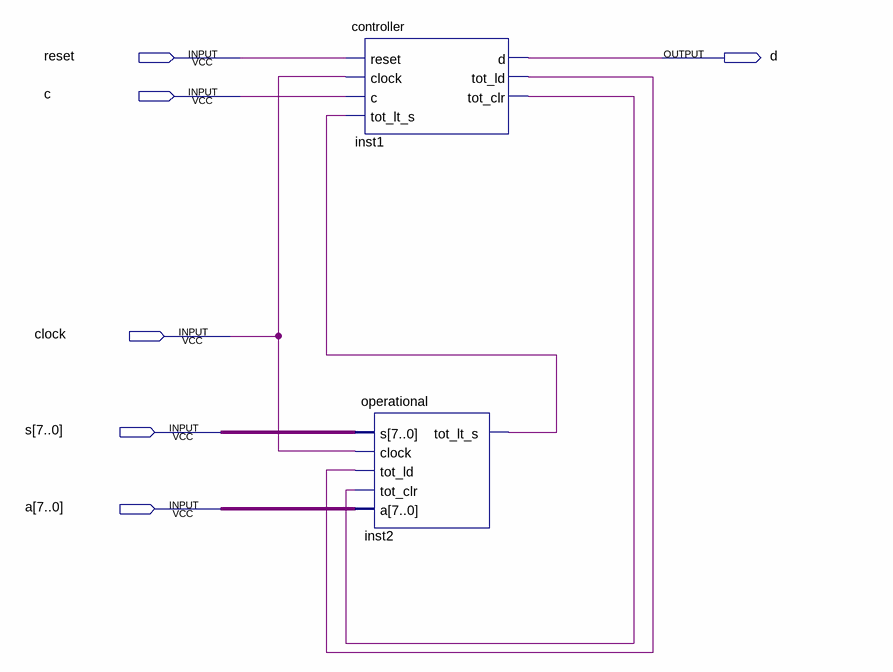
[diagram p0: schematic sheet]
// Quartus schematic system-2.bdf as structural Verilog: 2 symbols, 6 pins
module \system-2  (
  input  reset,
  input  c,
  input  clock,
  input  [7:0] s,
  input  [7:0] a,
  output d
);

  wire inst1_tot_clr, inst1_tot_ld, inst2_tot_lt_s;

  controller inst1 (
    .reset(reset), .clock(clock), .c(c), .tot_lt_s(inst2_tot_lt_s), .d(d), .tot_ld(inst1_tot_ld),
    .tot_clr(inst1_tot_clr));
  operational inst2 (
    .s(s), .clock(clock), .tot_ld(inst1_tot_ld), .tot_clr(inst1_tot_clr), .a(a), .tot_lt_s(inst2_tot_lt_s));
endmodule
